# EAGLE design xbee (EAGLE 5.08)
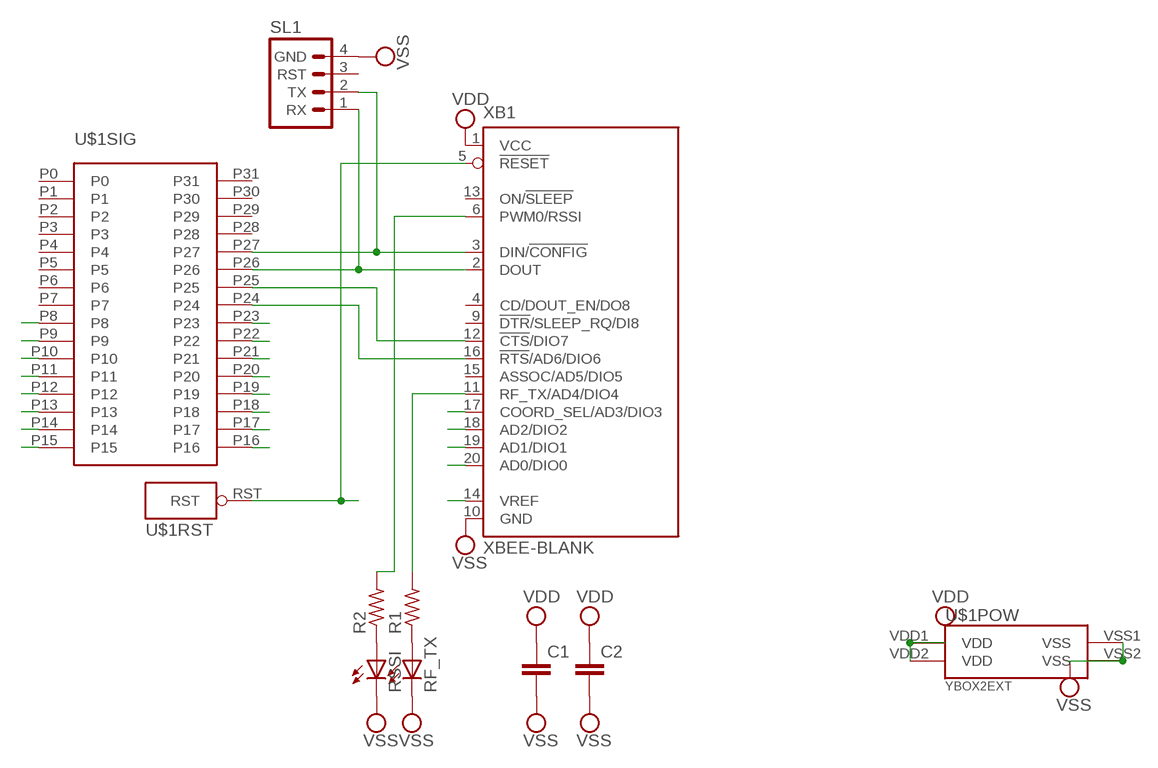
[diagram p0: schematic, sheet 1]

## Parts
C1  C-EU025-024X044  [C025-024X044]
C2  C-EU025-024X044  [C025-024X044]
R1  R-US_0204/7  [0204/7]
R2  R-US_0207/10  [0207/10]
RF_TX  LED3MM  [LED3MM]
RSSI  LED3MM  [LED3MM]
SL1  PROPPLUGPTH  [1X04]
U$1  YBOX2EXT  [YBOX2EXT]
XB1  XBEE-BLANK  [XBEE-BLANK]

## Nets
AD0: XB1.20(AD0/DIO0)
AD1: XB1.19(AD1/DIO1)
AD2: XB1.18(AD2/DIO2)
AD3: XB1.17(COORD_SEL/AD3/DIO3)
DIN: SL1.2(TX) U$1.P27(SIG:P27) XB1.3(DIN/!CONFIG)
DOUT: SL1.1(RX) U$1.P26(SIG:P26) XB1.2(DOUT)
N$3: U$1.RST(RST:RST) XB1.5(!RESET)
N$4: U$1.P25(SIG:P25) XB1.12(!CTS!/DIO7)
N$5: U$1.P24(SIG:P24) XB1.16(!RTS!/AD6/DIO6)
N$6: R1.2 XB1.11(RF_TX/AD4/DIO4)
N$7: R1.1 RF_TX.A
N$8: R2.1 RSSI.A
N$9: R2.2 XB1.6(PWM0/RSSI)
P8: U$1.P8(SIG:P8)
P9: U$1.P9(SIG:P9)
P10: U$1.P10(SIG:P10)
P11: U$1.P11(SIG:P11)
P12: U$1.P12(SIG:P12)
P13: U$1.P13(SIG:P13)
P14: U$1.P14(SIG:P14)
P15: U$1.P15(SIG:P15)
P16: U$1.P16(SIG:P16)
P17: U$1.P17(SIG:P17)
P18: U$1.P18(SIG:P18)
P19: U$1.P19(SIG:P19)
P20: U$1.P20(SIG:P20)
P21: U$1.P21(SIG:P21)
P22: U$1.P22(SIG:P22)
P23: U$1.P23(SIG:P23)
VDD: C1.1 C2.1 U$1.VDD1(POW:VDD) U$1.VDD2(POW:VDD) XB1.1(VCC)
VREF: XB1.14(VREF)
VSS: C1.2 C2.2 RF_TX.K(C) RSSI.K(C) SL1.4(GND) U$1.VSS1(POW:VSS) U$1.VSS2(POW:VSS) XB1.10(GND)
Unconnected: SL1.3(RST) U$1.P0(SIG:P0) U$1.P1(SIG:P1) U$1.P2(SIG:P2) U$1.P3(SIG:P3) U$1.P4(SIG:P4) U$1.P5(SIG:P5) U$1.P6(SIG:P6) U$1.P7(SIG:P7) U$1.P28(SIG:P28) U$1.P29(SIG:P29) U$1.P30(SIG:P30) U$1.P31(SIG:P31) XB1.4(CD/DOUT_EN/DO8) XB1.9(!DTR!/SLEEP_RQ/DI8) XB1.13(ON/!SLEEP) XB1.15(ASSOC/AD5/DIO5)

## Library data of the parts
C1 C2 = 0common:C-EU: CAPACITOR, European symbol
R1 R2 = 0common:R-US_: RESISTOR, American symbol
RF_TX RSSI = SparkFunEagle-6-6-07:LED: LEDs Standard schematic elements and footprints for 5mm, 3mm, 1206, and 0603 sized LEDs. 5mm - Spark Fun Electronics SKU : COM-00529 (and others)
SL1 = 0common:PROPPLUG: Header 4 Standard 4-pin 0.1" header. Use with straight break away headers (SKU : PRT-00116), right angle break away headers (PRT-00553), swiss pins (PRT-00743), machine pins (PRT-00117), and female headers (PRT-00115). Molex polarized connector foot print use with SKU : PRT-08231 with associated crimp pins and housings.
U$1 = 0common:YBOX2EXT
XB1 = maxstream:XBEE: XBee (TM) /XBee-PRO(TM) OEM RF Modules Source: MaxStream, Inc. xbee_productmanual.pdf

## Net classes
0 default: width 0.254 mm, clearance 0.254 mm

## Board
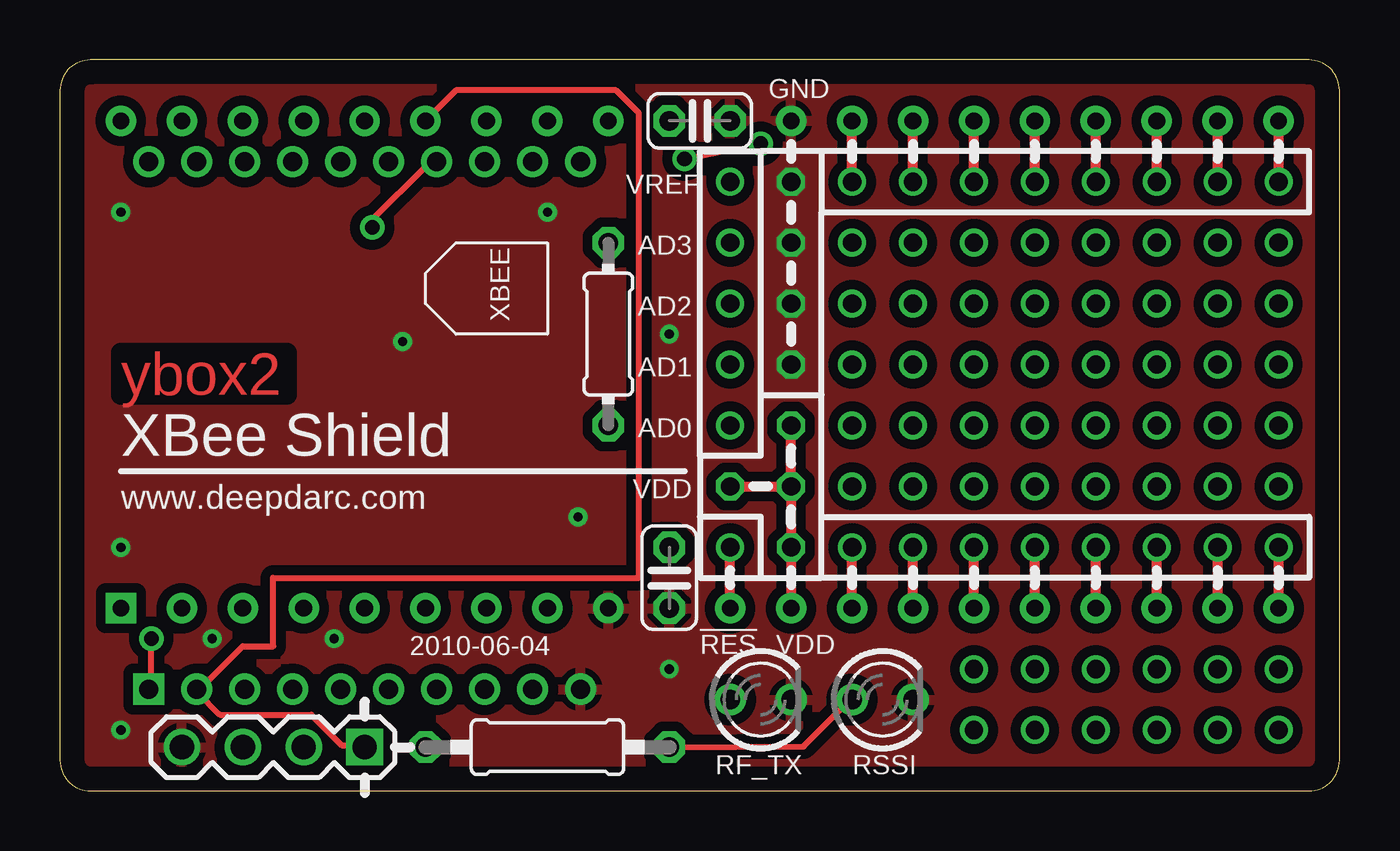
[diagram p1: board, top side]
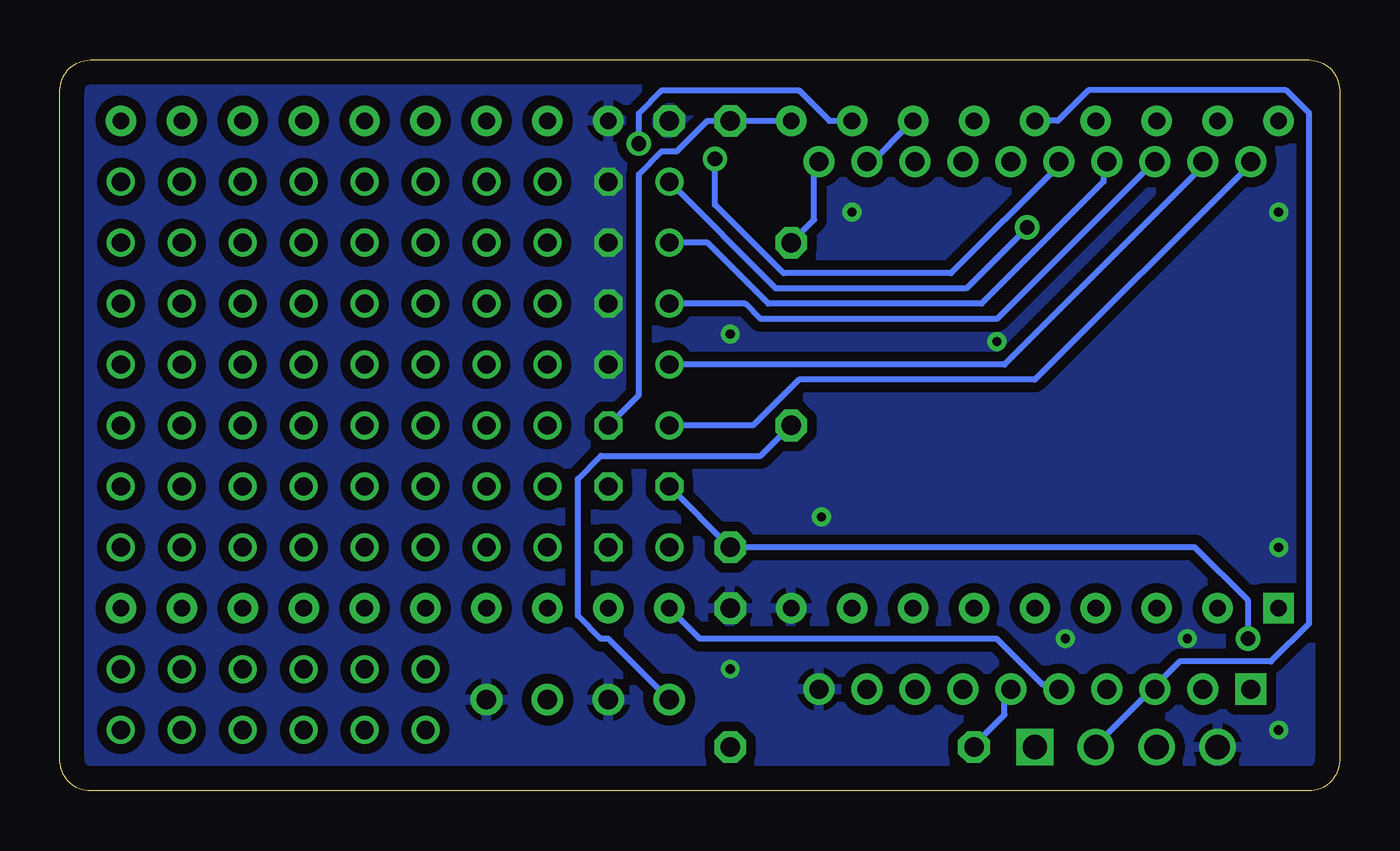
[diagram p2: board, bottom side, seen from below]

Size 53.34 x 30.48 mm. Coordinates in mm from the lower left corner, seen from the top.
Outline: 52.07,0 arc90 53.34,1.27 53.34,29.21 arc90 52.07,30.48 1.27,30.48 arc90 0,29.21 0,1.27 arc90 1.27,0 52.07,0
Copper layers (1*16): Top 0.035mm / dielectric 1.5mm / Bottom 0.035mm
Design rules "default": minimum track width 10mil, minimum drill 24mil, track to track 8mil, track to pad 8mil, pad to pad 8mil, via to via 8mil, smd to smd 8mil, copper to edge 40mil, drill to drill 8mil, minimum pad ring 10mil, minimum via ring 8mil, stop-mask expansion 4mil, vias tented up to drill 0mil, thermal gap 10mil

### Footprints (pad centres in the part's own frame; a part is rotated, then mirrored left to right if it is on the bottom)
C025-024X044 = drill 0.813 octagon: 1 -1.27,0; 2 1.27,0
0204/7 = drill 0.813 octagon: 1 -3.81,0; 2 3.81,0
0207/10 = drill 0.813 octagon: 1 -5.08,0; 2 5.08,0
LED3MM = drill 0.813 round: A -1.27,0; K 1.27,0
1X04 = drill 1.016 square: 1 0,0 | drill 1.016 round: 2 2.54,0; 3 5.08,0; 4 7.62,0
YBOX2EXT = drill 0.7 pad 1.27 square: P0 -10.16,23.495 | drill 0.7 pad 1.27 round: P1 -10.16,20.955; P2 -10.16,18.415; P3 -10.16,15.875; P4 -10.16,13.335; P5 -10.16,10.795; P6 -10.16,8.255; P7 -10.16,5.715; P8 -10.16,-6.985; P9 -10.16,-9.525; P10 -10.16,-12.065; P11 -10.16,-14.605; P12 -10.16,-17.145; P13 -10.16,-19.685; P14 -10.16,-22.225; P15 -10.16,-24.765; P16 10.16,-24.765; P17 10.16,-22.225; P18 10.16,-19.685; P19 10.16,-17.145; P20 10.16,-14.605; P21 10.16,-12.065; P22 10.16,-9.525; P23 10.16,-6.985; P24 10.16,5.715; P25 10.16,8.255; P26 10.16,10.795; P27 10.16,13.335; P28 10.16,15.875; P29 10.16,18.415; P30 10.16,20.955; P31 10.16,23.495; RST -10.16,-1.905; VDD1 10.16,3.175; VDD2 -10.16,-4.445; VSS1 -10.16,3.175; VSS2 10.16,-4.445
XBEE-BLANK = drill 0.8 pad 1.27 square: 1 -11,9 | drill 0.8 pad 1.27 round: 2 -11,7; 3 -11,5; 4 -11,3; 5 -11,1; 6 -11,-1; 7 -11,-3; 8 -11,-5; 9 -11,-7; 10 -11,-9; 11 11,-9; 12 11,-7; 13 11,-5; 14 11,-3; 15 11,-1; 16 11,1; 17 11,3; 18 11,5; 19 11,7; 20 11,9

### Placement (x,y rotation side)
C1  26.67,27.94 0 top
C2  25.4,8.89 270 top
R1  22.86,19.05 90 top
R2  20.32,1.83 180 top
RF_TX  29.21,3.81 0 top
RSSI  34.29,3.81 0 top
SL1  12.7,1.83 180 top
U$1  26.04,17.78 90 top
XB1  12.7,15.24 90 top

### Tracks (layer width: path | path; a pad name or v marks a point on that pad's centre or on a via)
AD0  (via drill 0.76)
  Bottom 0.254: v27.94,15.24 24.45,15.24 22.54,17.14 12.7,17.14 3.81,26.04 XB1.20
AD1  (via drill 0.76)
  Bottom 0.254: v27.94,17.78 13.97,17.78 5.71,26.04 XB1.19
AD2  (via drill 0.76)
  Bottom 0.254: v27.94,20.32 24.77,20.32 24.13,19.68 14.29,19.68 7.94,26.04 XB1.18
AD3  (via drill 0.76)
  Bottom 0.254: v27.94,22.86 26.35,22.86 23.81,20.32 14.92,20.32 9.84,25.4 9.84,26.04 XB1.17
DIN
  Bottom 0.254: U$1.P27 11.75,27.94 10.48,29.21 2.22,29.21 1.27,28.26 1.27,6.99 2.86,5.4 6.67,5.4 7.62,4.45 XB1.3 7.94,4.13 10.16,1.91 SL1.2
DOUT
  Top 0.254: U$1.P26 16.51,29.21 23.18,29.21 24.13,28.26 24.13,8.89 8.88,8.89 8.89,6.03 7.62,6.03 5.71,4.13 | 5.71,4.13 6.67,3.17 10.48,3.17 11.75,1.91 12.7,1.91 SL1.1 | XB1.2 5.71,4.13
N$3  (via drill 0.76)
  Top 0.406: U$1.RST v27.94,10.16
  Bottom 0.254: U$1.RST 26.67,6.35 14.29,6.35 12.38,4.45 11.75,4.45 XB1.5
N$4
  Bottom 0.254: U$1.P25 19.68,26.04 XB1.12
N$5  (via drill 0.61)
  Top 0.254: v29.21,26.99 28.89,26.67 27.62,26.67 v26.04,26.35
  Bottom 0.254: U$1.P24 21.27,27.94 22.54,29.21 28.26,29.21 29.21,28.26 v29.21,26.99 | v26.04,26.35 26.04,24.45 23.18,21.59 16.19,21.59 11.75,26.04 XB1.16
N$6
  Bottom 0.254: R1.2 21.91,23.81 21.91,26.04 XB1.11
N$7
  Bottom 0.254: RF_TX.A 30.48,6.35 30.8,6.35 31.75,7.3 31.75,13.02 30.8,13.97 24.13,13.97 R1.1
N$8
  Top 0.254: R2.1 31,1.85 32.98,3.83 | 32.98,3.83 33.03,3.89 | 32.98,3.83 32.7,3.81 RSSI.A
N$9
  Bottom 0.254: XB1.6 13.97,4.13 13.97,3.17 15.24,1.91 R2.2
N$10  (via drill 0.76)
  other vias: 50.8,5.08
N$11  (via drill 0.76)
  other vias: 48.26,5.08
N$12  (via drill 0.76)
  other vias: 45.72,5.08
N$13  (via drill 0.76)
  other vias: 43.18,5.08
N$14  (via drill 0.76)
  other vias: 40.64,5.08
N$15  (via drill 0.76)
  other vias: 38.1,5.08
N$16  (via drill 0.76)
  other vias: 38.1,2.54
N$17  (via drill 0.76)
  other vias: 40.64,2.54
N$18  (via drill 0.76)
  other vias: 43.18,2.54
N$19  (via drill 0.76)
  other vias: 50.8,22.86
N$20  (via drill 0.76)
  other vias: 48.26,22.86
N$21  (via drill 0.76)
  other vias: 45.72,22.86
N$22  (via drill 0.76)
  other vias: 43.18,22.86
N$23  (via drill 0.76)
  other vias: 40.64,22.86
N$24  (via drill 0.76)
  other vias: 38.1,22.86
N$25  (via drill 0.76)
  other vias: 35.56,22.86
N$26  (via drill 0.76)
  other vias: 33.02,22.86
N$27  (via drill 0.76)
  other vias: 45.72,2.54
N$28  (via drill 0.76)
  other vias: 48.26,2.54
N$29  (via drill 0.76)
  other vias: 33.02,20.32
N$30  (via drill 0.76)
  other vias: 35.56,20.32
N$31  (via drill 0.76)
  other vias: 38.1,20.32
N$32  (via drill 0.76)
  other vias: 40.64,20.32
N$33  (via drill 0.76)
  other vias: 43.18,20.32
N$34  (via drill 0.76)
  other vias: 45.72,20.32
N$35  (via drill 0.76)
  other vias: 48.26,20.32
N$36  (via drill 0.76)
  other vias: 50.8,20.32
N$37  (via drill 0.76)
  other vias: 50.8,17.78
N$38  (via drill 0.76)
  other vias: 48.26,17.78
N$39  (via drill 0.76)
  other vias: 45.72,17.78
N$40  (via drill 0.76)
  other vias: 43.18,17.78
N$41  (via drill 0.76)
  other vias: 40.64,17.78
N$42  (via drill 0.76)
  other vias: 38.1,17.78
N$43  (via drill 0.76)
  other vias: 35.56,17.78
N$44  (via drill 0.76)
  other vias: 33.02,17.78
N$45  (via drill 0.76)
  other vias: 50.8,2.54
N$47  (via drill 0.76)
  other vias: 33.02,15.24
N$48  (via drill 0.76)
  other vias: 35.56,15.24
N$49  (via drill 0.76)
  other vias: 38.1,15.24
N$50  (via drill 0.76)
  other vias: 40.64,15.24
N$51  (via drill 0.76)
  other vias: 43.18,15.24
N$52  (via drill 0.76)
  other vias: 45.72,15.24
N$53  (via drill 0.76)
  other vias: 48.26,15.24
N$54  (via drill 0.76)
  other vias: 50.8,15.24
N$55  (via drill 0.76)
  other vias: 50.8,12.7
N$56  (via drill 0.76)
  other vias: 48.26,12.7
N$57  (via drill 0.76)
  other vias: 45.72,12.7
N$58  (via drill 0.76)
  other vias: 43.18,12.7
N$59  (via drill 0.76)
  other vias: 40.64,12.7
N$60  (via drill 0.76)
  other vias: 38.1,12.7
N$61  (via drill 0.76)
  other vias: 35.56,12.7
N$62  (via drill 0.76)
  other vias: 33.02,12.7
P8  (via drill 0.76)
  Top 0.406: U$1.P8 v33.02,10.16
P9  (via drill 0.76)
  Top 0.406: U$1.P9 v35.56,10.16
P10  (via drill 0.76)
  Top 0.406: U$1.P10 v38.1,10.16
P11  (via drill 0.76)
  Top 0.406: U$1.P11 v40.64,10.16
P12  (via drill 0.76)
  Top 0.406: U$1.P12 v43.18,10.16
P13  (via drill 0.76)
  Top 0.406: U$1.P13 v45.72,10.16
P14  (via drill 0.76)
  Top 0.406: U$1.P14 v48.26,10.16
P15  (via drill 0.76)
  Top 0.406: U$1.P15 v50.8,10.16
P16  (via drill 0.76)
  Top 0.406: v50.8,25.4 U$1.P16
P17  (via drill 0.76)
  Top 0.406: v48.26,25.4 U$1.P17
P18  (via drill 0.76)
  Top 0.406: v45.72,25.4 U$1.P18
P19  (via drill 0.76)
  Top 0.406: v43.18,25.4 U$1.P19
P20  (via drill 0.76)
  Top 0.406: v40.64,25.4 U$1.P20
P21  (via drill 0.76)
  Top 0.406: v38.1,25.4 U$1.P21
P22  (via drill 0.76)
  Top 0.406: v35.56,25.4 U$1.P22
P23  (via drill 0.76)
  Top 0.406: v33.02,25.4 U$1.P23
VDD  (via drill 0.61, 0.76)
  Top 0.254: v3.81,6.35 3.81,4.45 XB1.1
  Top 0.406: U$1.VDD2 v30.48,10.16 v30.48,12.7 | v30.48,12.7 v30.48,15.24 | v27.94,12.7 v30.48,12.7
  Bottom 0.254: U$1.VDD1 C1.1 26.35,27.94 27.62,26.67 28.26,26.67 29.21,25.72 29.21,16.51 v30.48,15.24 | v27.94,12.7 C2.1 6.03,10.16 3.81,7.94 v3.81,6.35
VREF  (via drill 0.61, 0.76)
  Top 0.254: v13.02,23.5 13.02,23.81 15.24,26.04 15.56,26.04 XB1.14
  Bottom 0.254: v27.94,25.4 23.5,20.95 15.56,20.95 v13.02,23.5
VSS  (via drill 0.38, 0.76)
  other vias: 30.48,25.4 30.48,22.86 30.48,20.32 30.48,17.78 2.54,10.16 2.54,2.54 25.4,5.08 21.59,11.43 20.32,24.13 2.54,24.13 11.43,6.35 25.4,19.05 14.29,18.73 6.35,6.35
  pour Top (isolate 0.406): 53.34,30.48 0,30.48 0,0 53.34,0
  pour Bottom (isolate 0.406): 0,30.48 53.34,30.48 53.34,0 0,0

### Text on the board
Top: ybox2
tPlace: GND | VREF | AD3 | AD2 | XBEE | AD1 | AD0 | VDD | !RES | VDD
tNames: XBee Shield | www.deepdarc.com | 2010-06-04
tStop: ybox2